# EAGLE design Wand Battery rev2.1 (EAGLE 9.7.0)
Assembly variants: AA-Batteries
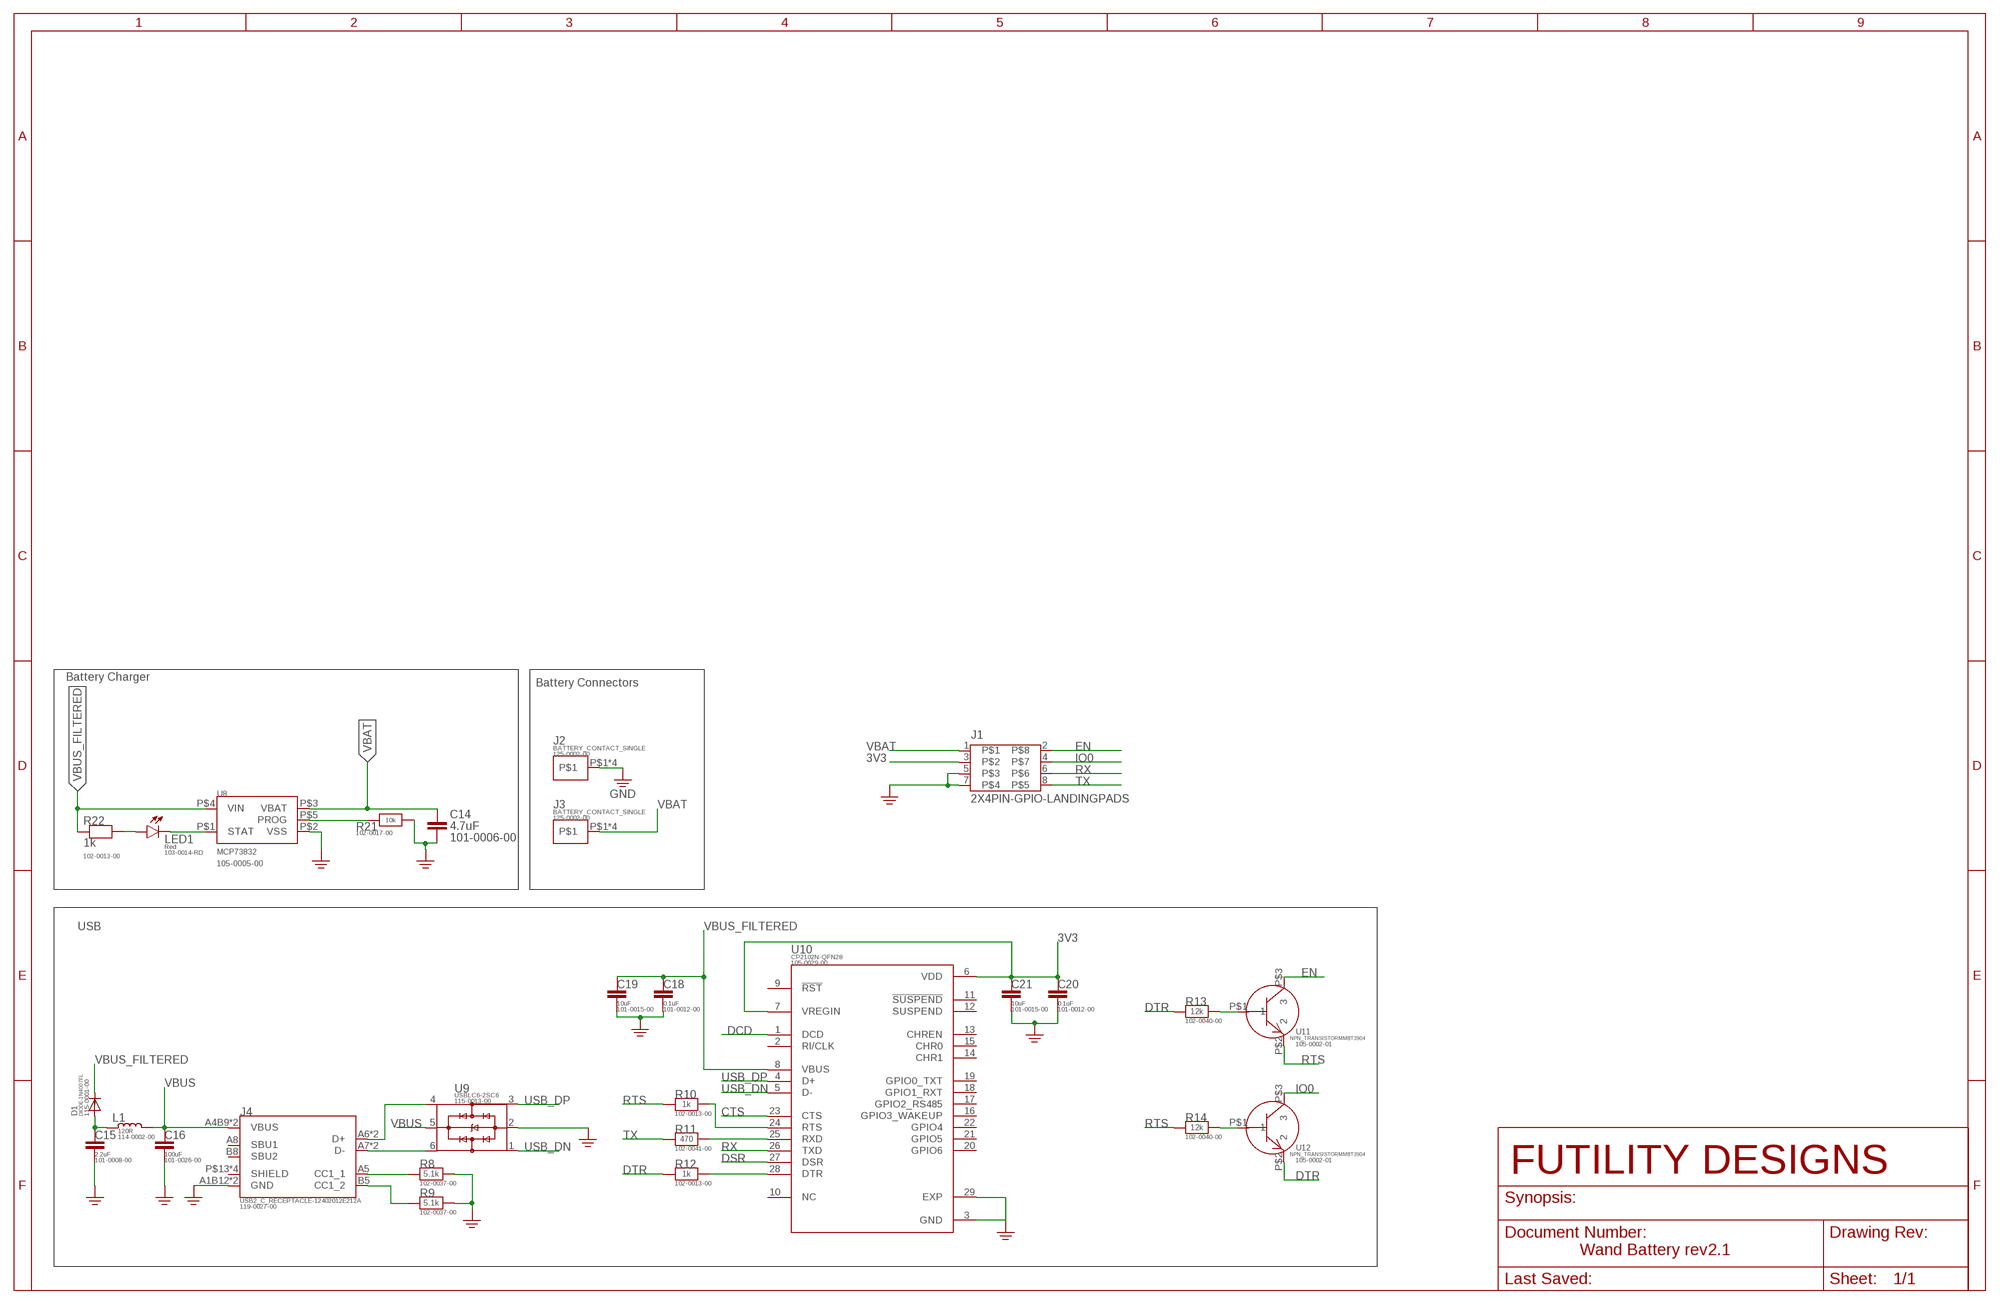
[diagram p0: schematic, sheet 1]

## Parts
C14  4.7uF  CAPACITOR-SMD-0402  [0402]
C15  2.2uF  CAPACITOR-SMD-0603  [0603]
C16  100uF  CAPACITOR-SMD-1210  [1210]
C18  0.1uF  CAPACITOR-SMD-0402  [0402]
C19  10uF  CAPACITOR-SMD-0402  [0402]
C20  0.1uF  CAPACITOR-SMD-0402  [0402]
C21  10uF  CAPACITOR-SMD-0402  [0402]
D1  DIODE-1N4007FL  [SOD-123FL]
J1  2X4PIN-GPIO-LANDINGPADS  [2X2PIN_HEADER_LANDING]
J2  BATTERY_CONTACT_SINGLE  [BH-129A-5]
J3  BATTERY_CONTACT_SINGLE  [BH-129A-5]
J4  USB2_C_RECEPTACLE-12402012E212A  [12402012E212A]
L1  120R  INDUCTOR0603  [0603]
LED1  Red  LED-RA_0603  [IN-S63AS]
R8  5.1k  RESISTOR-SMD0402  [0402]
R9  5.1k  RESISTOR-SMD0402  [0402]
R10  1k  RESISTOR-SMD0402  [0402]
R11  470  RESISTOR-SMD0402  [0402]
R12  1k  RESISTOR-SMD0402  [0402]
R13  12k  RESISTOR-SMD0402  [0402]
R14  12k  RESISTOR-SMD0402  [0402]
R21  10k  RESISTOR-SMD0402  [0402]
R22  1k  RESISTOR-SMD0402  [0402]
U8  MCP73832  [MCP73832]
U9  USBLC6-2SC6  [SOT95P280X145-6N]
U10  CP2102N-QFN28  [IC_CP2102N-A02-GQFN28R]
U11  NPN_TRANSISTORMMBT3904  [SOT23]
U12  NPN_TRANSISTORMMBT3904  [SOT23]

## Nets
3V3: C20.P$1 C21.P$1 J1.3 U10.6(VDD) U10.7(VREGIN)
CTS: U10.23(CTS)
DCD: U10.1(DCD)
DSR: U10.27(DSR)
DTR: R12.P$1 R13.P$1 U12.P$2
EN: J1.2 U11.P$3
GND: C14.P$2 C15.P$2 C16.P$2 C18.P$2 C19.P$2 C20.P$2 C21.P$2 J1.5 J1.7 J2.P$1 J2.P$2 J2.P$3 J2.P$4 J4.A1B12(GND) J4.B1A12(GND) R8.P$2 R9.P$2 R21.P$2 U8.P$2(VSS) U9.2(GND) U10.3(GND) U10.29(EXP)
IO0: J1.4 U12.P$3
N$10: C15.P$1 D1.P$2(ANODE) L1.P$1
N$16: LED1.P$1(C) U8.P$1(STAT)
N$18: LED1.P$2(A) R22.P$2
N$22: R21.P$1 U8.P$5(PROG)
N$27: J4.A6(D+) J4.B6(D+) U9.4(I/O2_OUT)
N$28: J4.A7(D-) J4.B7(D-) U9.6(I/O1_OUT)
N$30: J4.A5(CC1_1) R8.P$1
N$56: J4.B5(CC1_2) R9.P$1
N$57: R10.P$2 U10.24(RTS)
N$58: R11.P$2 U10.25(RXD)
N$59: R12.P$2 U10.28(DTR)
N$60: R13.P$2 U11.P$1
N$61: R14.P$2 U12.P$1
RTS: R10.P$1 R14.P$1 U11.P$2
RX: J1.6 U10.26(TXD)
TX: J1.8 R11.P$1
USB_DN: U9.1(I/O1_IN) U10.5(D-)
USB_DP: U9.3(I/O2_IN) U10.4(D+)
VBAT: C14.P$1 J1.1 J3.P$1 J3.P$2 J3.P$3 J3.P$4 U8.P$3(VBAT)
VBUS: C16.P$1 J4.A4B9(VBUS) J4.B4A9(VBUS) L1.P$2 U9.5(VBUS)
VBUS_FILTERED: C18.P$1 C19.P$1 D1.P$1(CATHODE) R22.P$1 U8.P$4(VIN) U10.8(VBUS)
Unconnected: J4.A8(SBU1) J4.B8(SBU2) J4.P$13(SHIELD) J4.P$14(SHIELD) J4.P$15(SHIELD) J4.P$16(SHIELD) U10.2(RI/CLK) U10.9(!RST) U10.10(NC) U10.11(!SUSPEND) U10.12(SUSPEND) U10.13(CHREN) U10.14(CHR1) U10.15(CHR0) U10.16(GPIO3_WAKEUP) U10.17(GPIO2_RS485) U10.18(GPIO1_RXT) U10.19(GPIO0_TXT) U10.20(GPIO6) U10.21(GPIO5) U10.22(GPIO4)

## Notes on the sheet
- Battery Charger
- Battery Connectors
- USB

## Library data of the parts
C14 = 1-chris-parts:CAPACITOR-SMD; PART_NUMBER: 101-0006-00
C15 = 1-chris-parts:CAPACITOR-SMD; PART_NUMBER: 101-0008-00
C16 = 1-chris-parts:CAPACITOR-SMD; PART_NUMBER: 101-0026-00
C18 C20 = 1-chris-parts:CAPACITOR-SMD; PART_NUMBER: 101-0012-00
C19 C21 = 1-chris-parts:CAPACITOR-SMD; PART_NUMBER: 101-0015-00
D1 = 1-chris-parts:DIODE; PART_NUMBER: 115-0001-00
J1 = 1-Chris-Connectors:2X4PIN-GPIO
J2 J3 = 1-Chris-Power:BATTERY_CONTACT_SINGLE; PART_NUMBER: 125-0002-00
J4 = 1-chris-parts:USB2_C_RECEPTACLE; PART_NUMBER: 119-0027-00
L1 = 1-chris-parts:INDUCTOR: Inductors 0603: 10nH Ceramic Inductor - microwire antenna/RF (Digikey: 712-1434-2-ND) 0805: 560nH Ceramic Inductor - RF (Digikey: 553-1047-1-ND) 270nH Ceramic Inductor - Q = 40@250MHz, +-5%, 1 Ohm DC Resistance (Digikey: 535-10506-2-ND) 1007 (2518 Metric) SMT: 10µH 10% 250mOhm 820mA 1007 Inductor (Digikey: 587-2189-1-ND) 22µH 10% 500mOhm 580mA 1007 Inductor (Digikey: 587-2190-1-ND) 47µH 10% 950mOhm 420mA 1007 Inductor (Digikey: 587-2191-1-ND) 47µH 5% 100mOhm 1A 1008 Inductor (Digikey: 732-1816-1-ND) 5.0x5.0mm (Taiyo Yuden NR5040 Series) 6.8µH 20% 2.3A 64mOhm Inductor (Digikey: 587-2374-2-ND) 5.0x5.0mm (TDK VLC5045 Series) 4.7µH 20% 3.3A 34mOhm Inductor (Digikey: 445-6526-1-ND) 6.8µH 20% 2.7A 46mOhm Inductor (Digikey: 445-6527-1-ND) 6.0x6.0mm (TDK VLC6045 Series) 4.7µH 20% 3.8A 27mOhm Inductor (Digikey: 445-6538-2-ND) 6.8µH 20% 3A 41mOhm Inductor (Digikey: 445-6540-1-ND) 6.2µH 30% 2.2A 45mOhm Inductor (Digikey: SRR5028-6R2YCT-ND) - Not TDK VLC6045 but footprint should match 6.0x6.0mm (TDK SLF6045 Series) 6.8uH 30% 2A 33mOhm Inductor (Digikey: 445-4572-1-ND, Mouser: 810-SLF645T6R8N2R0PF) 6.0x6.0mm (Sumida CDRH5D28 Series) 6.2uH 30% 1.8A 45mOhm Inductor (Digikey: 308-1542-1-ND) Taiyo Yuden NR3015T2R2M - 2.2uH 20% 1.5A (Digikey: 587-1648-2-ND, Mouser: 963-NR3015T2R2M) - Used with TI TPS62172 CoilCraft RFID Transponder Coil - MA5532-AE (For use with AS3935 Lightning Sensor) Vishay IHLP 1.0uH Molded Inductor - 24mOhm DCR, 5A, +/-20%, -55°C-125°C (Digikey: 541-1319-1-ND); PART_NUMBER: 114-0002-00
LED1 = 1-chris-parts:LED; PART_NUMBER: 103-0014-RD
R8 R9 = 1-chris-parts:RESISTOR-SMD; PART_NUMBER: 102-0037-00
R10 R12 R22 = 1-chris-parts:RESISTOR-SMD; PART_NUMBER: 102-0013-00
R11 = 1-chris-parts:RESISTOR-SMD; PART_NUMBER: 102-0041-00
R13 R14 = 1-chris-parts:RESISTOR-SMD; PART_NUMBER: 102-0040-00
R21 = 1-chris-parts:RESISTOR-SMD; PART_NUMBER: 102-0017-00
U8 = 1-chris-parts:MCP73832; PART_NUMBER: 105-0005-00
U9 = 1-chris-parts:USBLC6-2SC6: Check availability <https://pricing.snapeda.com/parts/USBLC6-2SC6/STMicroelectronics/view-part?ref=eda> Check availability <https://pricing.snapeda.com/parts/USBLC6-2SC6/STMicroelectronics/view-part?ref=eda>; MP: USBLC6-2SC6; PART_NUMBER: 115-0013-00
U10 = 1-chris-parts:CP2102N-QFN28; PART_NUMBER: 105-0029-00
U11 U12 = 1-chris-parts:NPN_TRANSISTOR; PART_NUMBER: 105-0002-01

## Net classes
1 diff pairs: width 0.152 mm

## Board
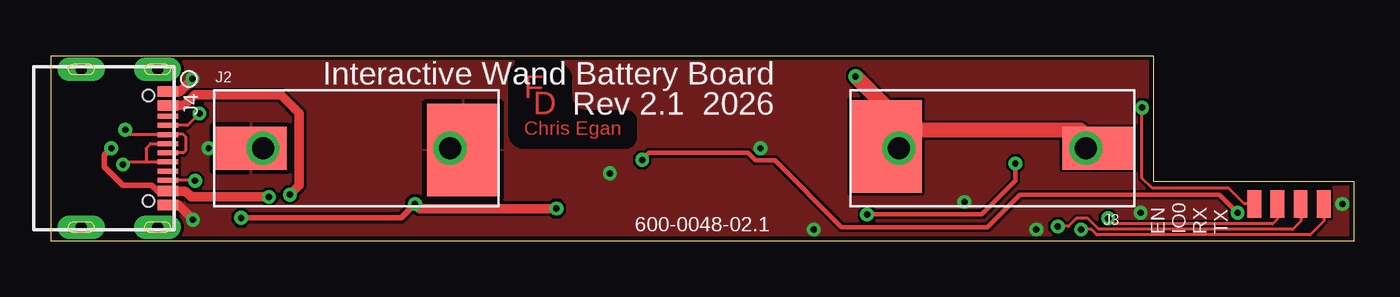
[diagram p1: board, top side]
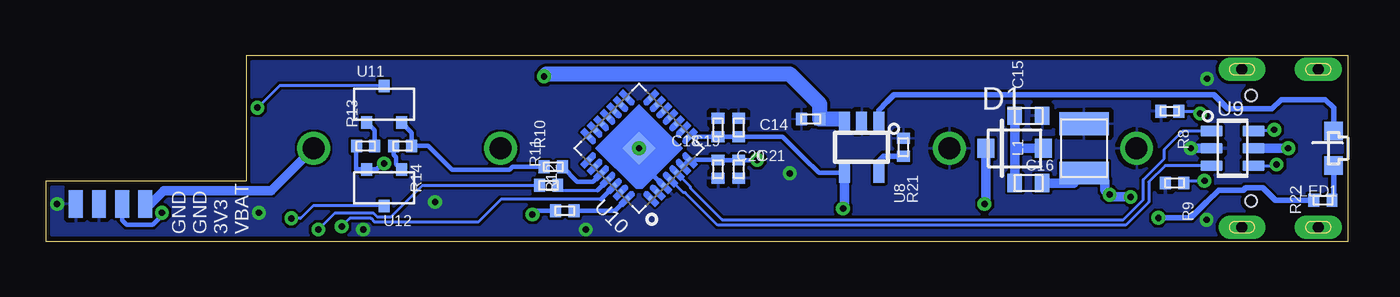
[diagram p2: board, bottom side, seen from below]

Size 71.37 x 10.16 mm. Coordinates in mm from the lower left corner, seen from the top.
Outline: 71.37,0 0,0 0,10.16 60.4,10.16 60.4,3.28 71.37,3.28 71.37,0
Copper layers (1*16): Top / Bottom
Stack-up Default Layer Stack: Top SilkScreen Epoxy Ink / Top SolderMask SR:Green 0.0254mm Dk 4.3 / Top Surface Finish Lead-Free 0.02mm / Top CuFoil:007 0.035mm / Dielectric-1 User Defined 0.7mm / Bottom CuFoil:007 0.035mm / Bottom Surface Finish Lead-Free 0.02mm / Bottom SolderMask SR:Green 0.0254mm Dk 4.3 / Bottom SilkScreen Epoxy Ink
Design rules: minimum copper width class=1 6mil, minimum copper width 6mil, minimum drill size 0.35mm, copper clearance wire_polygon to wire_polygon 6mil, copper clearance wire_polygon to pad_smd 6mil, copper clearance wire_polygon to via 6mil, copper clearance pad_smd to pad_smd 6mil, copper clearance pad_smd to via 6mil, copper clearance via to via 6mil, copper clearance smd to pad (same net) 6mil, copper clearance smd to via (same net) 6mil, copper clearance smd to smd (same net) 6mil, dimension clearance 10mil, via restrict clearance 0mil, restrict clearance 0mil, drill distance 6mil, keepout clearance 0mil

### Footprints (pad centres in the part's own frame; a part is rotated, then mirrored left to right if it is on the bottom)
0402 = smd 0.7 x 0.6: P$1 0,0.5; P$2 0,-0.5
0603 = smd 1 x 0.8: P$1 0,0.75; P$2 0,-0.75
1210 = smd 2.7 x 1.25: P$1 0,1.35; P$2 0,-1.35
SOD-123FL = smd 0.95 x 1.05: P$1 -1.575,0; P$2 1.575,0
2X2PIN_HEADER_LANDING = smd 0.762 x 1.524 bottom: 1 -1.905,-2.54; 3 -0.635,-2.54; 5 0.635,-2.54; 7 1.905,-2.54 | smd 0.762 x 1.524: 2 -1.905,-2.54; 4 -0.635,-2.54; 6 0.635,-2.54; 8 1.905,-2.54
BH-129A-5 = smd 3.96 x 2.34: P$1 -0.68,0 | smd 3.96 x 5.08: P$2 10.96,-0.1 | drill 1.2: P$3 0,0; P$4 10.25,0
12402012E212A = smd 0.58 x 1.14: A1B12 -3.1,4.75; A4B9 -2.35,4.75; B1A12 3.1,4.75; B4A9 2.35,4.75 | smd 0.27 x 1.14: A5 -1.25,4.75; A6 -0.25,4.75; A7 0.25,4.75; A8 1.25,4.75; B5 1.75,4.75; B6 0.75,4.75; B7 -0.75,4.75; B8 -1.75,4.75 | drill 0.6 pad 1.3 long: P$13 -4.32,0; P$14 4.32,0; P$15 -4.32,4.18; P$16 4.32,4.18 | hole 0.65: -2.89,3.68; 2.89,3.68
IN-S63AS = smd 1 x 1: P$1 -0.95,0; P$2 0.95,0
MCP73832 = smd 0.6 x 1.1: P$1 -0.95,-1.4; P$2 0,-1.4; P$3 0.95,-1.4; P$4 0.95,1.4; P$5 -0.95,1.4
SOT95P280X145-6N = smd 1.2 x 0.6: 1 -1.15,0.95; 2 -1.15,0; 3 -1.15,-0.95; 4 1.15,-0.95; 5 1.15,0; 6 1.15,0.95
IC_CP2102N-A02-GQFN28R = smd 0.25 x 0.25: 1 -2.4,1.5; 2 -2.4,1; 3 -2.4,0.5; 4 -2.4,0; 5 -2.4,-0.5; 6 -2.4,-1; 7 -2.4,-1.5; 8 -1.5,-2.4; 9 -1,-2.4; 10 -0.5,-2.4; 11 0,-2.4; 12 0.5,-2.4; 13 1,-2.4; 14 1.5,-2.4; 15 2.4,-1.5; 16 2.4,-1; 17 2.4,-0.5; 18 2.4,0; 19 2.4,0.5; 20 2.4,1; 21 2.4,1.5; 22 1.5,2.4; 23 1,2.4; 24 0.5,2.4; 25 0,2.4; 26 -0.5,2.4; 27 -1,2.4; 28 -1.5,2.4 | smd 1.27 x 1.27: 29 0,0
SOT23 = smd 0.6 x 0.7: P$1 -0.95,-1; P$2 0.95,-1; P$3 0,1

### Placement (x,y rotation side)
C14  29.46,6.68 270 bottom
C15  17.53,6.86 90 bottom
C16  14.48,5.08 180 bottom
C18  34.54,6.22 180 bottom
C19  33.4,6.22 180 bottom
C20  34.54,3.94 0 bottom
C21  33.4,3.94 0 bottom
D1  18.29,5.08 0 bottom
J1  67.82,4.57 0 top
J2  11.61,5.08 0 top
J3  56.69,5.08 180 top
J4  1.65,5.08 270 top
L1  17.53,3.17 90 bottom
LED1  0.81,5.08 270 bottom
R8  9.78,7.11 270 bottom
R9  9.53,3.17 270 bottom
R10  43.56,4.06 90 bottom
R11  43.81,3.05 90 bottom
R12  42.93,1.65 90 bottom
R13  53.85,5.21 90 bottom
R14  51.82,5.21 270 bottom
R21  24.38,5.13 180 bottom
R22  1.4,2.24 90 bottom
U8  26.67,5.13 180 bottom
U9  6.35,5.08 0 bottom
U10  38.86,5.08 135 bottom
U11  52.83,7.49 0 bottom
U12  52.83,2.92 180 bottom
U$1  [LOGO_SMALLER]  25.91,5.79 0 top

### Tracks (layer width: path | path; a pad name or v marks a point on that pad's centre or on a via)
3V3  (via drill 0.35)
  Top 0.254: v32.38,4.45 32.77,4.83 38.19,4.83 38.59,4.42 39.65,4.42 43.31,0.76 47.24,0.76 51.31,0.76 53.09,2.54 64.01,2.54 v65,1.55
  Bottom 0.254: C21.P$1 | 36.45,4.09 U10.6 U10.7 34.55,4.44 C20.P$1 C21.P$1 | C21.P$1 32.39,4.44 v32.38,4.45 | J1.3 67.18,1.14 66.93,0.89 65.52,0.89 65,1.41 v65,1.55
DTR  (via drill 0.35)
  Top 0.254: v52.83,4.24 52.83,3.3 51.01,1.48 44.73,1.48 v44.7,1.45
  Bottom 0.254: R13.P$1 54.36,5.2 54.36,3.92 U12.P$2 53.23,3.92 52.91,4.24 v52.83,4.24 | v44.7,1.45 44.5,1.65 R12.P$1
EN  (via drill 0.35)
  Top 0.152: v59.77,7.31 59.77,3.45 60.32,2.9 64.51,2.9 65.37,2.03 J1.2
  Bottom 0.152: U11.P$3 52.85,8.51 58.55,8.51 59.75,7.31 v59.77,7.31
GND  (via drill 0.35)
  Top 0.508: J4.A1B12 7.04,8.18 v7.75,8.89 | J4.B1A12 6.96,1.98 v7.77,1.17
  Top 0.813: J2.P$2 21.96,4.98 J2.P$4 | J2.P$1 J2.P$3
  Bottom 0.254: U10.3 38.86,4.37 U10.29
  Bottom 0.508: U9.2 v8.64,5.08
  other vias: 70.74,2.03 38.86,5.08 30.61,3.71 50.04,2.14 53.98,0.63 41.78,0.63 59.69,1.55
  pour Top: -8.84,16.76 71.3,16.76 71.3,-0.63 -8.84,-0.63
  pour Bottom: -9.22,17.14 -9.22,-1.52 71.3,-1.52 71.3,17.26
IO0  (via drill 0.35)
  Top 0.152: J1.4 67.18,1.2 66.92,0.94 58.21,0.94 v57.91,1.24
  Bottom 0.152: U12.P$3 56.73,1.92 57.41,1.24 v57.91,1.24
N$10
  Bottom 0.508: L1.P$1 18.28,5.08 | 18.28,5.08 C15.P$1 | D1.P$2 18.28,5.08
N$16
  Bottom 0.305: LED1.P$1 0.81,7.29 1.27,7.75 3.68,7.75 4.19,7.24 6.6,7.24 7.37,8 17.91,8 24.89,8 25.27,7.62 25.72,7.17 U8.P$1
N$18
  Bottom 0.305: R22.P$2 0.81,2.32 LED1.P$2
N$22
  Bottom 0.305: U8.P$5 25.72,4.38 25.53,4.57 25.47,4.63 R21.P$1
N$27  (via drill 0.35)
  Top 0.152: v3.94,4.19 4.08,4.33 5.21,4.33 | 5.21,4.33 J4.B6 | J4.A6 5.46,5.33 5.33,5.21 5.21,5.08 5.21,4.33
  Bottom 0.152: U9.4 4,4.13 v3.94,4.19
N$28  (via drill 0.35)
  Top 0.152: v4.06,6.1 4.33,5.83 J4.B7 6.41,5.84 7.24,5.84 7.37,5.71 7.37,4.95 7.24,4.83 J4.A7
  Bottom 0.152: U9.6 4.13,6.03 v4.06,6.1
N$30  (via drill 0.35)
  Top 0.152: v8.13,6.99 7.47,6.33 J4.A5
  Bottom 0.152: R8.P$1 8.26,7.11 v8.13,6.99
N$56  (via drill 0.35)
  Top 0.152: J4.B5 7.59,3.33 7.62,3.3 v7.89,3.3
  Bottom 0.152: R9.P$1 8.9,3.3 v7.89,3.3
N$57
  Bottom 0.254: R10.P$2 42.25,3.25 41.4,3.25 U10.24
N$58
  Bottom 0.152: R11.P$2 43.06,2.79 41.15,2.79
  Bottom 0.254: 41.15,2.79 U10.25 | 41.15,2.79
N$59
  Bottom 0.254: R12.P$2 40.17,1.65 U10.28 | U10.28
N$60
  Bottom 0.254: R13.P$2 53.35,6.06 U11.P$1
N$61
  Bottom 0.254: R14.P$2 52.32,4.73 52.17,4.59 52.17,4.21 U12.P$1
RTS
  Bottom 0.254: U11.P$2 51.32,5.93 R14.P$1 50.42,5.21 49.11,3.9 45.95,3.9 45.79,4.06 R10.P$1
RX  (via drill 0.35)
  Top 0.152: J1.6 68.45,1.07 68.01,0.63 57.41,0.63 56.81,1.24 56.18,1.24 55.74,0.8 v55.15,0.8
  Bottom 0.152: 40.95,2.29 46.42,2.29 47.67,1.04 53.35,1.04 53.55,1.24 54.71,1.24 v55.15,0.8
  Bottom 0.254: U10.26 40.95,2.29 | 40.95,2.29
TX  (via drill 0.35)
  Top 0.152: J1.8 69.72,1.07 68.98,0.33 57.29,0.33 56.98,0.63 v56.43,0.63
  Bottom 0.152: R11.P$1 50.73,3.05 52.44,1.34 53.23,1.34 53.43,1.54 55.52,1.54 v56.43,0.63
USB_DN
  Bottom 0.152: U9.1 9.08,6.03 10.1,5.02 10.1,4.51 11.24,3.37 11.24,2.25 12.32,1.17 34.32,1.17 36.07,2.92 36.07,2.99 U10.5
USB_DP
  Bottom 0.152: U10.4 | U9.3 10.04,4.13 10.94,3.24 10.94,2.13 12.2,0.87 34.55,0.87 36.34,2.65 36.43,2.65 U10.4
VBAT  (via drill 0.35)
  Top 0.508: 46.44,6.64 J3.P$4
  Top 0.813: v44.07,9.02 46.44,6.64 | J3.P$4 46.34,5.18 J3.P$2 45.73,5.43 46.37,6.07 56.38,6.07 J3.P$1 J3.P$3
  Bottom 0.508: U8.P$3 27.77,6.68 | 43.94,9.14 v44.07,9.02 | J3.P$3 59.01,2.76 64.89,2.76 65.63,2.03 J1.1
  Bottom 0.813: 27.77,6.68 C14.P$1 28.96,7.5 29.21,7.75 30.61,9.14 40.01,9.14 43.94,9.14
VBUS  (via drill 0.35)
  Top 0.305: v3.3,5.08 2.92,4.7 2.92,4.06 3.94,3.05 4.83,3.05 5.51,3.05 5.67,2.88 5.83,2.73 J4.B4A9
  Top 0.508: J4.B4A9 7.35,2.73 7.67,2.41 8.38,2.41 v11.94,2.41 | J4.A4B9 7.3,7.43 7.49,7.62 7.87,8 9.27,8 12.57,8 13.34,7.24 13.59,6.99 13.59,4.32 13.59,3.05 v13.08,2.54
  Bottom 0.508: L1.P$2 15.03,3.17 C16.P$1 13.76,3.73 13.34,3.3 13.34,2.79 v13.08,2.54 12.95,2.41 v11.94,2.41 | U9.5 v3.3,5.08
VBUS_FILTERED  (via drill 0.35)
  Top 0.305: v10.41,1.27 19.18,1.27 v19.94,2.03
  Top 0.508: v27.69,1.78 20.19,1.78 v19.94,2.03
  Bottom 0.254: U10.8 C18.P$1 C19.P$1 31,5.72 29.84,4.57 29,3.73 U8.P$4 | 27.62,1.84 v27.69,1.78
  Bottom 0.305: R22.P$1 4.01,2.23 4.7,2.92 5.63,2.92 5.76,2.79 7.11,2.79 7.75,2.16 8.64,1.27 v10.41,1.27
  Bottom 0.508: v19.94,2.03 19.86,2.11 D1.P$1 | U8.P$4 27.62,1.84

### Text on the board
SilkscreenTop: Interactive Wand Battery Board | Rev 2.1 2026 | 600-0048-02.1 | EN / IO0 / RX / TX
SilkscreenBottom: GND / GND / 3V3 / VBAT